# EasyEDA Pro project 有源低通滤波器.eprj

# Schematic Schematic1
Create Date: 2023-07-09; Page Name: P1; Project Name: 有源低通滤波器; Schematic Name: Schematic1; Update Date: 2023-07-09; Company: 嘉立创EDA; Page Size: A4; Version: V1.0
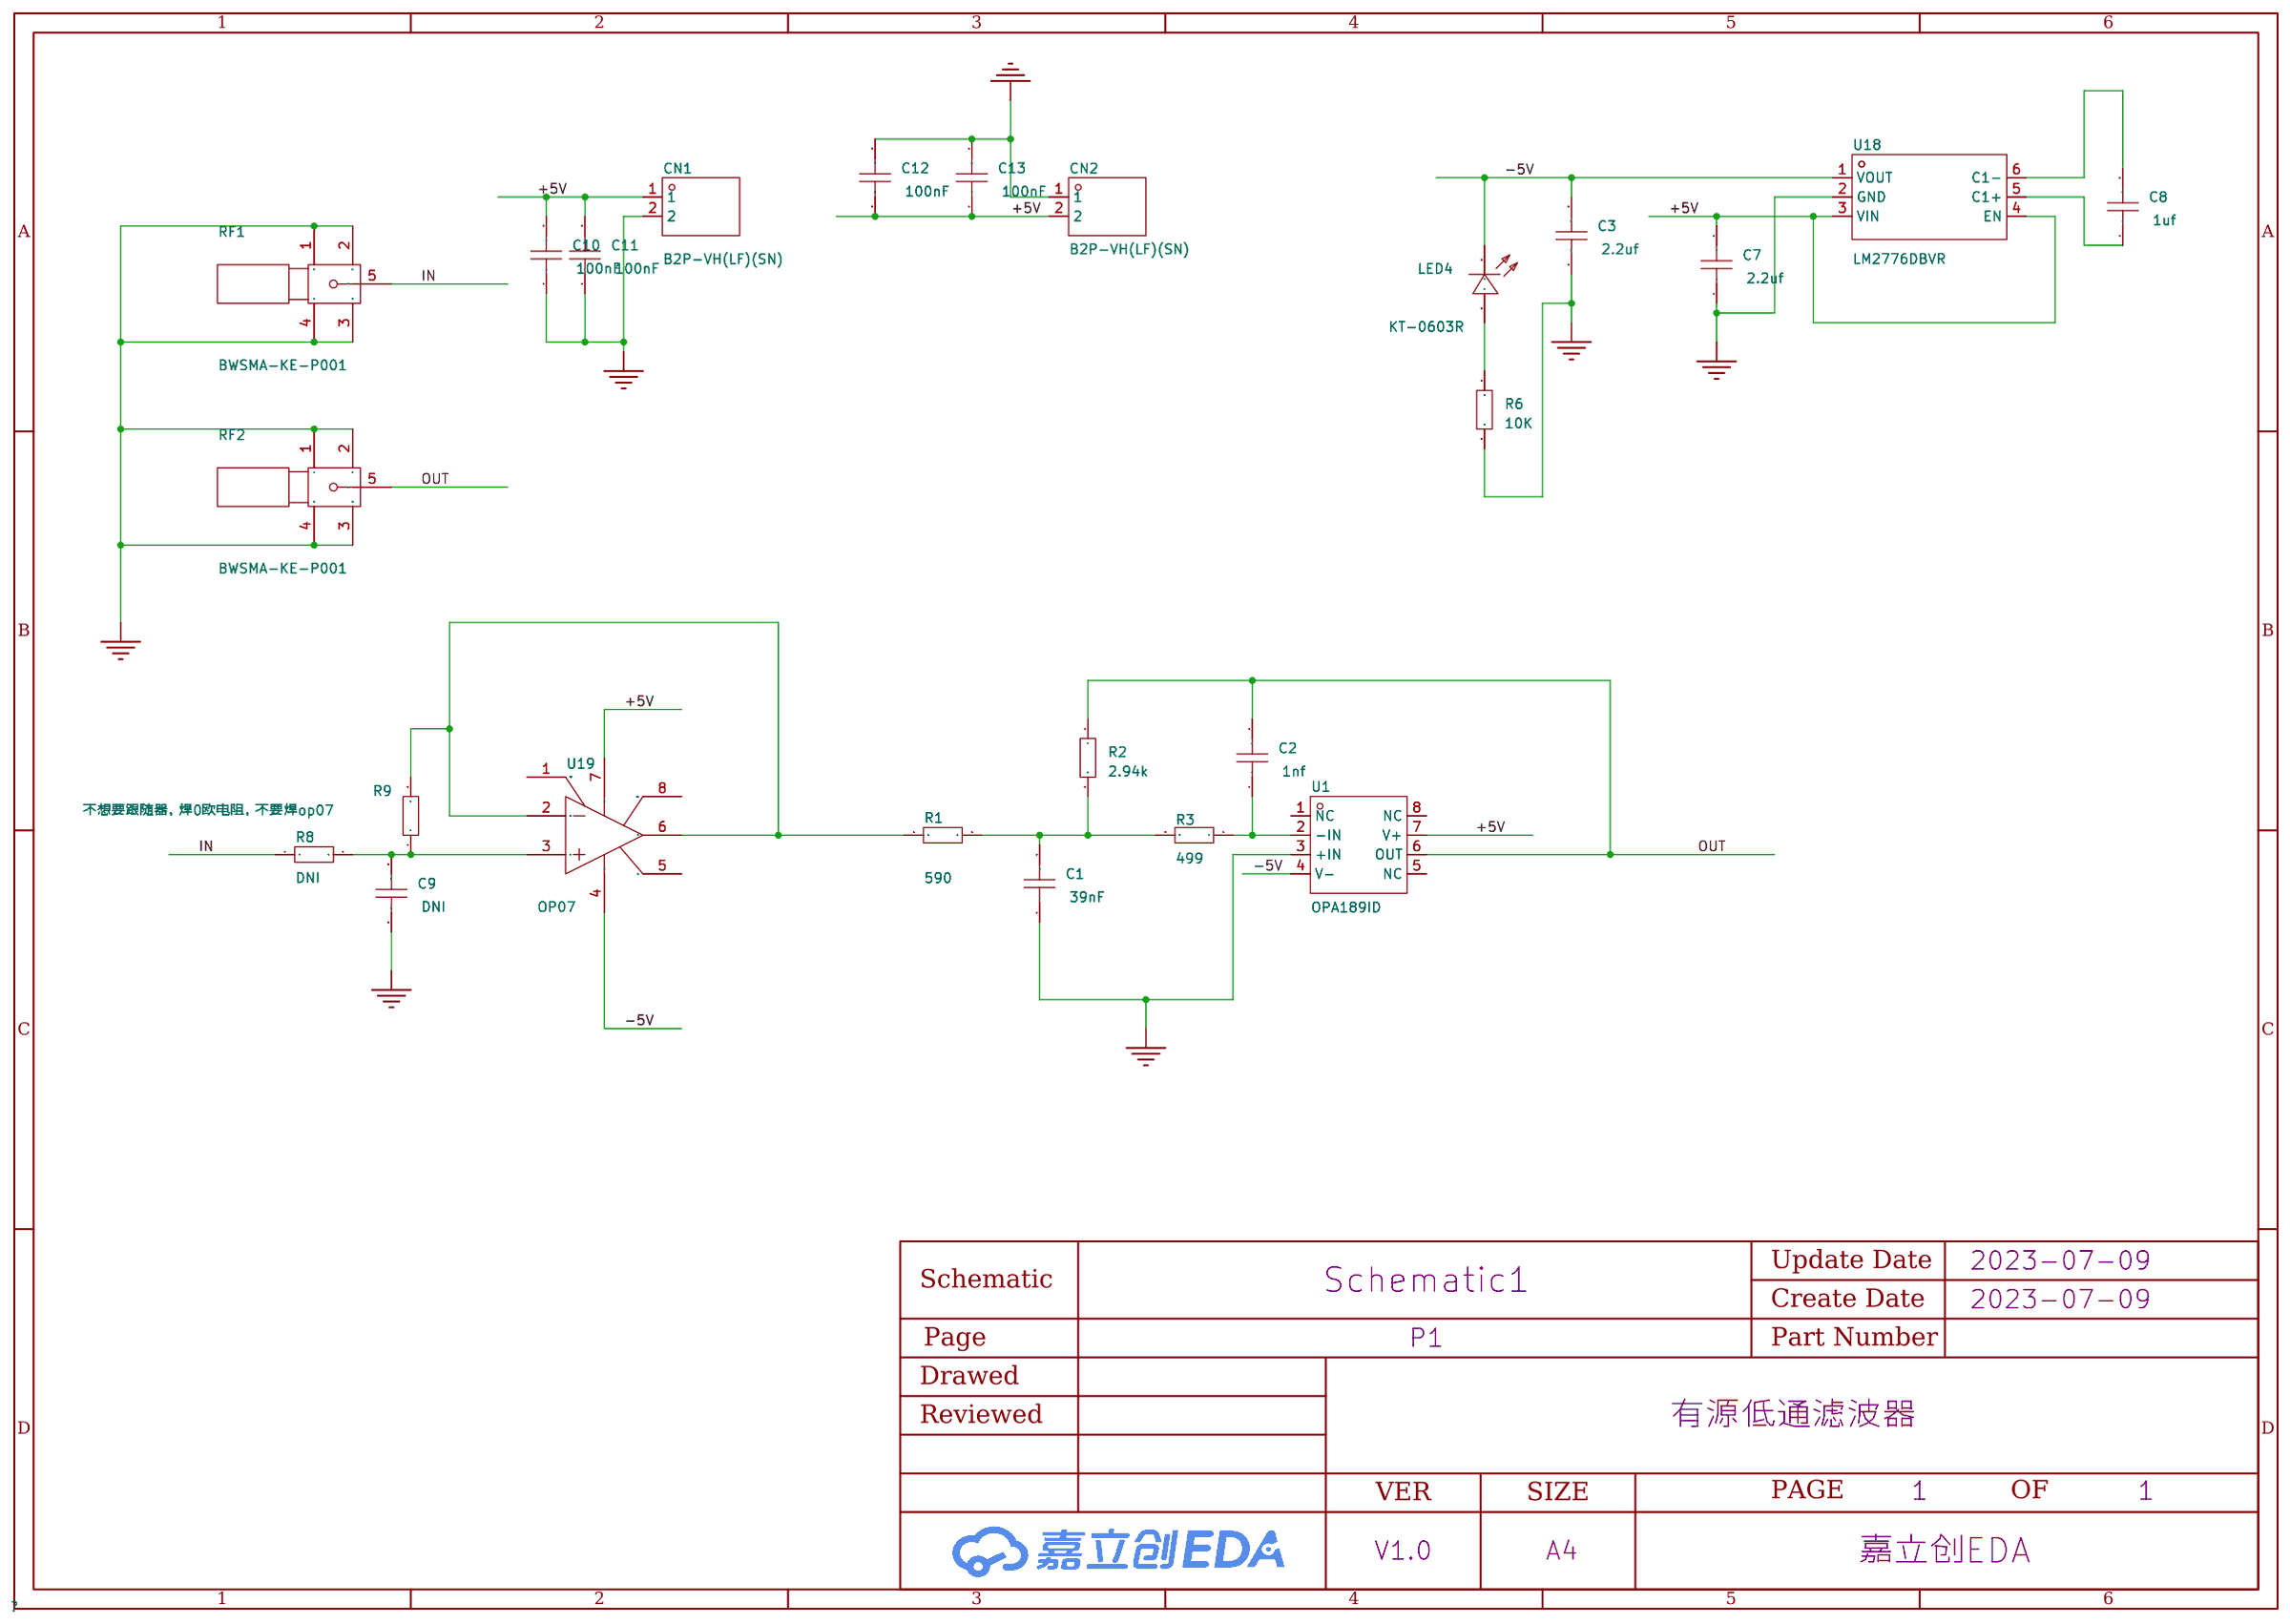
[diagram p0: schematic sheet]

## Parts
C1  39nF  [C0603]
C2  1nf  [C0603]
C3  2.2uf  [C0603]
C7  2.2uf  [C0603]
C8  1uf  [C0603]
C9  DNI  [C0603]
C10  100nF  [C0603]
C11  100nF  [C0603]
C12  100nF  [C0603]
C13  100nF  [C0603]
CN1  B2P-VH(LF)(SN)  [CONN-TH_B2P-VH-LF-SN]
CN2  B2P-VH(LF)(SN)  [CONN-TH_B2P-VH-LF-SN]
LED4  KT-0603R  [LED0603-RD]
R1  590  [R0603]
R2  2.94k  [R0603]
R3  499  [R0603]
R6  10K  [R0603]
R8  DNI  [R0603]
R9  不想要跟随器，焊0欧电阻，不要焊op07  [R0603]
RF1  BWSMA-KE-P001  [SMA-SMD_BWSMA-KE-P001]
RF2  BWSMA-KE-P001  [SMA-SMD_BWSMA-KE-P001]
U1  OPA189ID  [SOIC-8_L4.9-W3.9-P1.27-LS6.0-BL]
U18  LM2776DBVR  [SOT-23-6_L2.9-W1.6-P0.95-LS2.8-BR]
U19  OP07  [SOP-8_L4.9-W3.9-P1.27-LS6.0-BL]

## Library data of the parts
C1-C3 C7-C13 = CAP_0603: Supplier Footprint: 0603
CN1 CN2 = B2P-VH (LF)(SN): 参考系列:VH;间距:3.96mm;插针结构:1x2P;排数:1;每排PIN数:2;行距:-;安装方式:-;触头材质:黄铜;; LCSC Part Name: VH 3.96mm 1x2P 直插; Supplier Part: C160315; Manufacturer: JST; Supplier Footprint: 插件,P=3.96mm; JLCPCB Part Class: Extended Part; Datasheet: https://atta.szlcsc.com/upload/public/pdf/source/20180420/C160315_19C451141449BB9E1CAF8D49BAD03192.pdf; Supplier: LCSC; Reference Series: VH; Pitch: 3.96mm; Pins Structure: 1x2P; Number of Rows: 1; Number of PINs Per Row: 2; Contact Material: 黄铜
LED4 = KT-0603R: 发光颜色:红灯;二极管配置:-;透镜颜色:-;主波长:-;色温:-;功率:-;发光角度:-;安装方式:-;工作温度:-40℃~+85℃;; LCSC Part Name: 0603 红灯 高亮; Supplier Part: C2286; Manufacturer: KENTO; Supplier Footprint: 0603; JLCPCB Part Class: 基础库; Datasheet: https://atta.szlcsc.com/upload/public/pdf/source/20160616/1466072038404.pdf; Supplier: LCSC; Emitted Color: 红灯; Operating Temperature: -40℃~+85℃
R1-R3 R6 R8 R9 = Res_0603: Supplier Footprint: 0603
RF1 RF2 = BWSMA-KE-P001: 连接器类型:板端;射频系列:SMA;接口类型:内孔;端口数量:1;阻抗:50Ω;频率-最大值:12.4GHz;样式:偏脚;接口直径:5.2mm;接口长度/高度:-;工作温度范围:-;; LCSC Part Name: SMA 内孔 偏脚 SMA偏脚板端座子; Supplier Part: C496550; Manufacturer: BAT WIRELESS(蝙蝠无线); Supplier Footprint: 插件; JLCPCB Part Class: Extended Part; Datasheet: https://atta.szlcsc.com/upload/public/pdf/source/20200416/C496550_06668BF2E3B968EA39F96D17E7156373.pdf; Supplier: LCSC; Connector Type: 板端; RF Series: SMA; Interface Type: 内孔; Number of Ports: 1; Impedance: 50Ω; Frequency-Max: 12.4GHz; Style: 偏脚; Interface Diameter: 5.2mm
U1 = OPA189ID: 单路、14MHz、多路复用器友好型、低噪声、零漂移 、RRO、CMOS 精密运算放大器 8-SOIC -40 to 125; Supplier Part: C1346427; Manufacturer: TI(德州仪器); Supplier Footprint: SOIC-8; JLCPCB Part Class: 扩展库; Datasheet: https://atta.szlcsc.com/upload/public/pdf/source/20230221/021F59F95BC801D8417AEA2742D4D2F8.pdf; Supplier: LCSC
U18 = LM2776DBVR: 可输出电流:200mA;开关工作频率:2MHz;输出类型:Fixed;输出电压的路数:1;功能类型:Ratiometric;输出配置:Negative;; Supplier Part: C69527; Manufacturer: TI(德州仪器); Supplier Footprint: SOT-23-6; JLCPCB Part Class: Extended Part; Datasheet: https://atta.szlcsc.com/upload/public/pdf/source/20170908/C69527_1504870089399958035.pdf; Supplier: LCSC
U19 = OP07: 放大器组数:-;; Supplier Part: C1508997; Manufacturer: 杭州瑞盟; Supplier Footprint: SOP-8; JLCPCB Part Class: 扩展库; Datasheet: https://atta.szlcsc.com/upload/public/pdf/source/20201221/C1508997_31DB1D3DFE7BEFB064DC1C62AA82E0AA.pdf; Supplier: LCSC

## Nets
+5V: C7.2 C10.2 C11.2 C12.1 C13.1 CN1.1 CN2.2 U1.7(V+) U18.3(VIN) U18.4(EN) U19.7(V+)
-5V: C3.2 LED4.1(K) U1.4(V-) U18.1(VOUT) U19.4(V-)
GND: C1.1 C3.1 C7.1 C9.1 C10.1 C11.1 C12.2 C13.2 CN1.2 CN2.1 R6.2 RF1.1 RF1.2 RF1.3 RF1.4 RF2.1 RF2.2 RF2.3 RF2.4 U1.3(+IN) U18.2(GND)
IN: R8.1 RF1.5
OUT: C2.2 R2.1 RF2.5 U1.6(OUT)
$1N1168: LED4.2(A) R6.1
$1N1419: C1.2 R1.2 R2.2 R3.2
$1N1504: C2.1 R3.1 U1.2(-IN)
Net-(C8-1): C8.1 U18.5(C1+)
Net-(C8-2): C8.2 U18.6(C1-)
Net-(C9-2): C9.2 R8.2 R9.1 U19.3(IN+)
Net-(R1-1): R1.1 R9.2 U19.2(IN-) U19.6(OUT)

Not connected (* = marked no-connect by the designer): U1 1(NC) 5(NC) 8(NC); U19 1(VOS TRIM) 5(NC) 8(VOS TRIM)

# Board PCB1
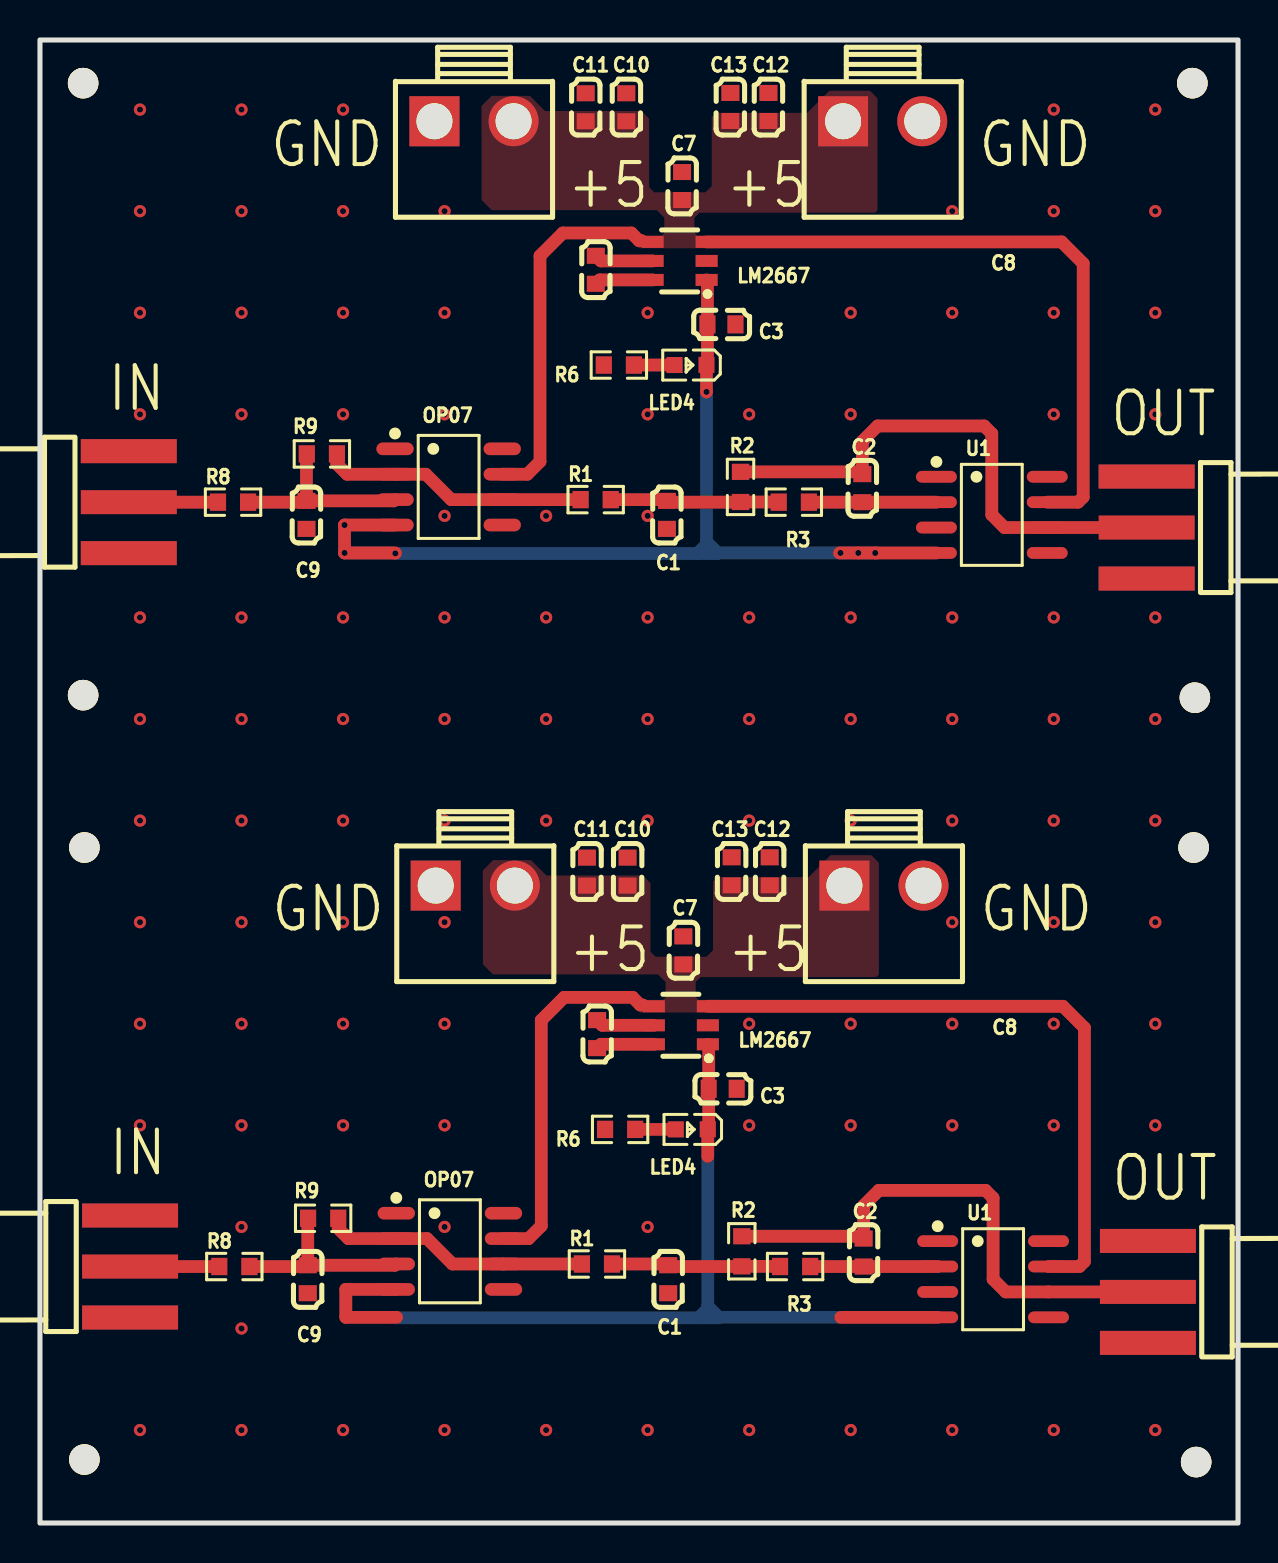
[diagram p1: board, top side]
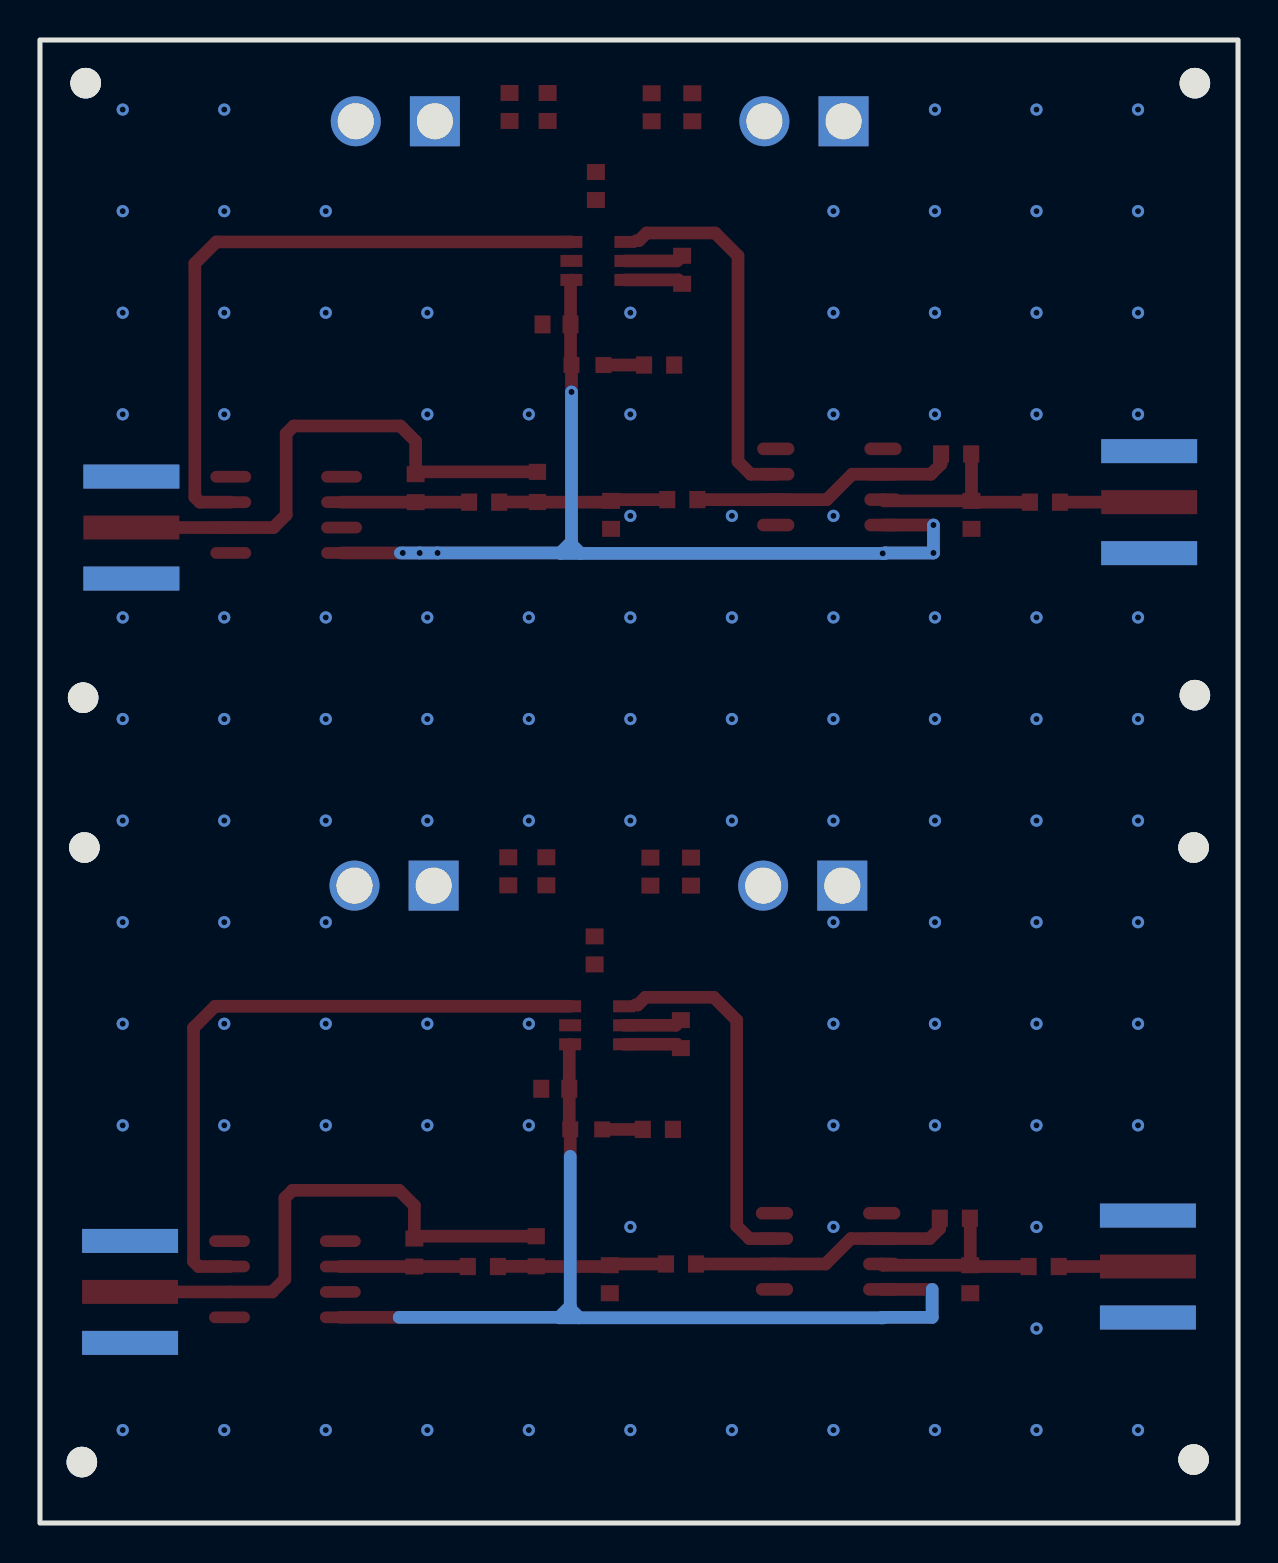
[diagram p2: board, bottom side, seen from below]

Outline 59.94 x 74.17 mm; copper layers: Top Layer, Bottom Layer. Coordinates in mm from the lower left corner of the outline.
Outline path: rectangle 0,74.17 59.94,0
Stack: Top Layer 0.035mm / Dielectric1 1.51mm FR4 er 4.5 / Bottom Layer 0.035mm

## Design rules (mm)
spacing safeClearance (default): track to track 0.152, other pairs 0.152 to 0.3
track width trackWidth (default): min 0.127, default 0.254, max 2.54
differential pair differentialPair (default): width min 0.127, default 0.254, max 2.54; gap min 0.152, default 0.152
via viaSize (default): diameter min 0.5, default 0.61, max 10; hole min 0.3, default 0.305, max 6

## Placement (name value [footprint] x y rotation side)
C1  39nF  [C0603]  31.37 50.42 90 top
C1#2  -  [C0603]  31.43 12.19 90 top
C2  1nf  [C0603]  41.15 51.75 90 top
C2#2  -  [C0603]  41.21 13.53 90 top
C3  2.2uf  [C0603]  34.16 21.72 180 top
C3#2  -  [C0603]  34.1 59.94 180 top
C7  2.2uf  [C0603]  32.13 66.86 270 top
C7#2  -  [C0603]  32.19 28.64 270 top
C8  1uf  [C0603]  27.88 24.45 270 top
C8#2  -  [C0603]  27.81 62.68 270 top
C9  DNI  [C0603]  13.33 50.42 90 top
C9#2  -  [C0603]  13.4 12.19 90 top
C10  100nF  [C0603]  29.34 70.8 270 top
C10#2  -  [C0603]  29.4 32.58 270 top
C11  100nF  [C0603]  27.37 32.58 270 top
C11#2  -  [C0603]  27.3 70.8 270 top
C12  100nF  [C0603]  36.45 70.82 90 top
C12#2  -  [C0603]  36.51 32.59 90 top
C13  100nF  [C0603]  34.54 70.82 90 top
C13#2  -  [C0603]  34.61 32.59 90 top
CN1  B2P-VH(LF)(SN)  [CONN-TH_B2P-VH-LF-SN]  42.16 70.1 0 top
CN1#2  -  [CONN-TH_B2P-VH-LF-SN]  42.23 31.88 0 top
CN2  B2P-VH(LF)(SN)  [CONN-TH_B2P-VH-LF-SN]  21.78 31.88 0 top
CN2#2  -  [CONN-TH_B2P-VH-LF-SN]  21.72 70.1 0 top
LED4  KT-0603R  [LED0603-RD]  32.61 19.69 180 top
LED4#2  -  [LED0603-RD]  32.55 57.92 180 top
LM2667  -  [SOT-23-6_L2.9-W1.6-P0.95-LS2.8-BR]  32 63.12 0 top
LM2667#2  -  [SOT-23-6_L2.9-W1.6-P0.95-LS2.8-BR]  32.07 24.89 0 top
NOREF  -  [SMA-SMD_BWSMA-KE-P001]  4.44 51.05 180 top
NOREF#2  -  [SMA-SMD_BWSMA-KE-P001]  4.51 12.83 180 top
NOREF#3  -  [Pad_e875]  57.72 33.78 0 top
NOREF#4  -  [Pad_e868]  2.22 33.78 0 top
NOREF#5  -  [Pad_e20]  2.16 72.01 0 top
NOREF#6  -  [Pad_e23]  2.16 41.4 0 top
NOREF#7  -  [Pad_e24]  57.78 41.27 0 top
NOREF#8  -  [Pad_e859]  57.85 3.05 0 top
NOREF#9  -  [Pad_e22]  57.66 72.01 0 top
NOREF#10  -  [Pad_e869]  2.22 3.17 0 top
OP07  -  [SOP-8_L4.9-W3.9-P1.27-LS6.0-BL]  20.45 51.82 270 top
OP07#2  -  [SOP-8_L4.9-W3.9-P1.27-LS6.0-BL]  20.51 13.59 270 top
R1  590  [R0603]  27.8 51.18 0 top
R1#2  -  [R0603]  27.87 12.95 0 top
R2  2.94k  [R0603]  35.05 51.82 270 top
R2#2  -  [R0603]  35.12 13.59 270 top
R3  499  [R0603]  37.72 51.05 180 top
R3#2  -  [R0603]  37.78 12.83 180 top
R6  10K  [R0603]  29.03 19.69 180 top
R6#2  -  [R0603]  28.96 57.91 180 top
R8  DNI  [R0603]  9.66 51.05 0 top
R8#2  -  [R0603]  9.72 12.83 0 top
R9  不想要跟随器，焊0欧电阻，不要焊op07  [R0603]  14.11 53.47 0 top
R9#2  -  [R0603]  14.17 15.24 0 top
RF2  BWSMA-KE-P001  [SMA-SMD_BWSMA-KE-P001]  55.37 49.78 0 top
RF2#2  -  [SMA-SMD_BWSMA-KE-P001]  55.44 11.56 0 top
U1  OPA189ID  [SOIC-8_L4.9-W3.9-P1.27-LS6.0-BL]  47.62 50.42 270 top
U1#2  -  [SOIC-8_L4.9-W3.9-P1.27-LS6.0-BL]  47.69 12.19 270 top

## Footprints (pads in the part's own frame, mm; a bottom-side part is the same pattern mirrored in y, then rotated)
C0603
  rect 0.8x0.9 smd: 1(-0.7,0) 2(0.7,0)
CONN-TH_B2P-VH-LF-SN
  rect 2.5x2.5 hole 1.8: 1(-1.98,0)
  round 2.5 hole 1.8: 2(1.98,0)
LED0603-RD
  rect 0.8x0.8 smd: 1(-0.799,-0.004) 2(0.799,0.004)
Pad_e20
  round 1.524 hole 3: 1(0,0)
Pad_e22
  round 1.524 hole 3: 1(0,0)
Pad_e23
  round 1.524 hole 3: 1(0,0)
Pad_e24
  round 1.524 hole 3: 1(0,0)
Pad_e859
  round 1.524 hole 3: 1(0,0)
Pad_e868
  round 1.524 hole 3: 1(0,0)
Pad_e869
  round 1.524 hole 3: 1(0,0)
Pad_e875
  round 1.524 hole 3: 1(0,0)
R0603
  rect 0.806x0.864 smd: 1(-0.753,0) 2(0.753,0)
SMA-SMD_BWSMA-KE-P001
  rect 4.8x1.2 smd: 1(0,-2.55) 2(0,2.55) 5(0,0)
  rect 4.8x1.2 smd far side: 3(0,2.55) 4(0,-2.55)
SOIC-8_L4.9-W3.9-P1.27-LS6.0-BL
  oval 0.588x2.045 smd: 1(-1.905,-2.772) 2(-0.635,-2.772) 3(0.635,-2.772) 4(1.905,-2.772) 5(1.905,2.772) 6(0.635,2.772) 7(-0.635,2.772) 8(-1.905,2.772)
SOP-8_L4.9-W3.9-P1.27-LS6.0-BL
  oval 0.63x1.865 smd: 1(-1.905,-2.683) 2(-0.635,-2.683) 3(0.635,-2.683) 4(1.905,-2.683) 5(1.905,2.683) 6(0.635,2.683) 7(-0.635,2.683) 8(-1.905,2.683)
SOT-23-6_L2.9-W1.6-P0.95-LS2.8-BR
  rect 1.1x0.6 smd: 1(1.35,-0.95) 2(1.35,0) 3(1.35,0.95) 4(-1.35,0.95) 5(-1.35,0) 6(-1.35,-0.95)

## Nets
+5V: C7.2 C7#2.2 C10.2 C10#2.2 C11.2 C11#2.2 C12.1 C12#2.1 C13.1 C13#2.1 CN1.1 CN1#2.1 CN2.2 CN2#2.2 LM2667.3 LM2667.4 LM2667#2.3 LM2667#2.4 OP07.7 OP07#2.7 U1.7 U1#2.7
-5V: C3.2 C3#2.2 LED4.1 LED4#2.1 LM2667.1 LM2667#2.1 OP07.4 OP07#2.4 U1.4 U1#2.4
GND: C1.1 C1#2.1 C3.1 C3#2.1 C7.1 C7#2.1 C9.1 C9#2.1 C10.1 C10#2.1 C11.1 C11#2.1 C12.2 C12#2.2 C13.2 C13#2.2 CN1.2 CN1#2.2 CN2.1 CN2#2.1 LM2667.2 LM2667#2.2 NOREF.1 NOREF.2 NOREF.3 NOREF.4 NOREF#2.1 NOREF#2.2 NOREF#2.3 NOREF#2.4 R6.2 R6#2.2 RF2.1 RF2.2 RF2.3 RF2.4 RF2#2.1 RF2#2.2 RF2#2.3 RF2#2.4 U1.3 U1#2.3
IN: NOREF.5 NOREF#2.5 R8.1 R8#2.1
OUT: C2.2 C2#2.2 R2.1 R2#2.1 RF2.5 RF2#2.5 U1.6 U1#2.6
$1N1165: C8.1 C8#2.1 LM2667.5 LM2667#2.5
$1N1166: C8.2 C8#2.2 LM2667.6 LM2667#2.6
$1N1168: LED4.2 LED4#2.2 R6.1 R6#2.1
$1N1419: C1.2 C1#2.2 R1.2 R1#2.2 R2.2 R2#2.2 R3.2 R3#2.2
$1N1504: C2.1 C2#2.1 R3.1 R3#2.1 U1.2 U1#2.2
$1N1994: OP07.2 OP07.6 OP07#2.2 OP07#2.6 R1.1 R1#2.1 R9.2 R9#2.2
$1N2080: C9.2 C9#2.2 OP07.3 OP07#2.3 R8.2 R8#2.2 R9.1 R9#2.1

Pads without a net: NOREF#3 1; NOREF#4 1; NOREF#5 1; NOREF#6 1; NOREF#7 1; NOREF#8 1; NOREF#9 1; NOREF#10 1; OP07 1 5 8; OP07#2 1 5 8; U1 1 5 8; U1#2 1 5 8

## Via types
v1: diameter 0.61, hole 0.304, Top Layer to Bottom Layer, 106 vias
v2: diameter 0.61, hole 0.305, Top Layer to Bottom Layer, 7 vias

## Routing (per net, layer and track width the routed paths; a pad name or vN(x,y) marks a point on that pad's centre or on a via; arc(x,y) is an arc through that point)
+5V: length 102.1
  Top Layer w0.635: 23.13,52.45 24.38,52.45 25.02,53.09 25.02,63.37 26.16,64.52 29.59,64.52 29.97,64.13 30.1,64.13 ; U1.7 51.94,51.05 52.2,51.31 52.2,62.99 51.12,64.07 LM2667.3 ; U1#2.7 52.01,12.83 52.26,13.08 52.26,24.77 51.18,25.84 LM2667#2.3 ; OP07#2.7 24.45,14.22 25.08,14.86 25.08,25.15 26.23,26.29 29.65,26.29 30.04,25.91 30.16,25.91
-5V: length 108.4
  Top Layer w0.635: v2(33.35,56.57) LED4#2.1 33.4,57.97 C3#2.2 33.4,62.12 LM2667.1 ; LM2667#2.1 33.46,23.9 C3.2 33.46,19.74 LED4.1 33.41,18.34 ; U1.4 v2(41.79,48.51) v2(40.94,48.51) 40,48.51 ; OP07.4 v2(15.24,49.91) v2(15.24,48.51) 17.78,48.51 ; 40.07,10.29 U1#2.4 ; 17.84,10.29 15.3,10.29 15.3,11.68 OP07#2.4
  Bottom Layer w0.635: 32.89,48.49 33.35,48.95 33.35,49.07 ; 32.89,48.49 v2(17.78,48.49) ; 32.89,48.49 33.89,48.49 33.91,48.51 ; 33.35,49.07 v2(33.35,56.57) ; 33.35,49.07 33.91,48.51 ; v2(17.78,48.49) 17.68,48.49 17.65,48.51 ; v2(17.78,48.49) 17.65,48.51 ; 33.97,10.29 41.97,10.29 ; 33.97,10.29 33.95,10.26 32.96,10.26 ; 33.97,10.29 33.41,10.85 ; 32.96,10.26 33.41,10.72 33.41,10.85 ; 32.96,10.26 17.84,10.26 ; 17.84,10.26 17.72,10.29 ; 17.84,10.26 17.74,10.26 17.72,10.29 ; 17.72,10.29 15.3,10.29 15.3,11.68 ; 17.65,48.51 v2(15.24,48.51) v2(15.24,49.91) ; 33.91,48.51 v2(40.05,48.51) v2(40.94,48.51) 41.91,48.51 ; 33.41,10.85 33.41,18.34
GND:
  vias: v1(5,70.69) v1(5,65.61) v1(5,60.53) v1(5,55.45) v1(5,45.29) v1(5,40.21) v1(5,35.13) v1(5,30.05) v1(5,24.97) v1(5,19.89) v1(5,4.65) v1(10.08,70.69) v1(10.08,65.61) v1(10.08,60.53) v1(10.08,55.45) v1(10.08,45.29) v1(10.08,40.21) v1(10.08,35.13) v1(10.08,30.05) v1(10.08,24.97) v1(10.08,19.89) v1(10.08,14.81) v1(10.08,9.73) v1(10.08,4.65) v1(15.16,70.69) v1(15.16,65.61) v1(15.16,60.53) v1(15.16,55.45) v1(15.16,45.29) v1(15.16,40.21) v1(15.16,35.13) v1(15.16,30.05) v1(15.16,24.97) v1(15.16,19.89) v1(15.16,4.65) v1(20.24,65.61) v1(20.24,60.53) v1(20.24,55.45) v1(20.24,50.37) v1(20.24,45.29) v1(20.24,40.21) v1(20.24,35.13) v1(20.24,30.05) v1(20.24,24.97) v1(20.24,19.89) v1(20.24,14.81) v1(20.24,4.65) v1(25.32,50.37) v1(25.32,45.29) v1(25.32,40.21) v1(25.32,35.13) v1(25.32,4.65) v1(30.4,60.53) v1(30.4,55.45) v1(30.4,50.37) v1(30.4,45.29) v1(30.4,40.21) v1(30.4,35.13) v1(30.4,14.81) v1(30.4,4.65) v1(35.48,55.45) v1(35.48,45.29) v1(35.48,40.21) v1(35.48,35.13) v1(35.48,24.97) v1(35.48,19.89) v1(35.48,4.65) v1(40.56,60.53) v1(40.56,55.45) v1(40.56,45.29) v1(40.56,40.21) v1(40.56,35.13) v1(40.56,24.97) v1(40.56,19.89) v1(40.56,4.65) v1(45.64,65.61) v1(45.64,60.53) v1(45.64,45.29) v1(45.64,40.21) v1(45.64,35.13) v1(45.64,30.05) v1(45.64,24.97) v1(45.64,19.89) v1(45.64,4.65) v1(50.72,70.69) v1(50.72,65.61) v1(50.72,60.53) v1(50.72,55.45) v1(50.72,45.29) v1(50.72,40.21) v1(50.72,35.13) v1(50.72,30.05) v1(50.72,24.97) v1(50.72,19.89) v1(50.72,4.65) v1(55.8,70.69) v1(55.8,65.61) v1(55.8,60.53) v1(55.8,55.45) v1(55.8,45.29) v1(55.8,40.21) v1(55.8,35.13) v1(55.8,30.05) v1(55.8,24.97) v1(55.8,19.89) v1(55.8,4.65)
IN: length 8.9
  Top Layer w0.635: NOREF.5 R8.1 ; NOREF#2.5 R8#2.1
OUT: length 53.6
  Top Layer w0.635: R2.1 41.03,52.57 C2.2 41.15,54.1 41.91,54.86 47.24,54.86 47.62,54.48 47.62,50.42 48.26,49.78 U1.6 RF2.5 ; R2#2.1 41.1,14.34 C2#2.2 41.21,15.88 41.97,16.64 47.31,16.64 47.69,16.26 47.69,12.19 48.32,11.56 U1#2.6 RF2#2.5
$1N1165: length 5.9
  Top Layer w0.635: C8.1 28.13,24.89 LM2667#2.5 ; C8#2.1 28.07,63.12 LM2667.5
$1N1166: length 5.8
  Top Layer w0.635: C8#2.2 28.01,62.17 LM2667.6 ; C8.2 28.07,23.94 LM2667#2.6
$1N1168: length 4.1
  Top Layer w0.635: R6#2.1 LED4#2.2 ; R6.1 31.81,19.69
$1N1419: length 16.9
  Top Layer w0.635: R3.2 36.96,51.06 R2.2 35.04,51.05 31.43,51.05 C1.2 31.31,51.18 R1.2 ; R1#2.2 31.37,12.95 C1#2.2 31.5,12.83 35.11,12.83 R2#2.2 37.02,12.84 R3#2.2
$1N1504: length 12.8
  Top Layer w0.635: R3#2.1 C2#2.1 U1#2.2 ; R3.1 C2.1 U1.2
$1N1994: length 26.9
  Top Layer w0.635: R9#2.2 14.92,14.73 15.43,14.22 OP07#2.2 19.37,14.22 20.64,12.95 OP07#2.6 R1#2.1 ; R1.1 OP07.6 20.57,51.18 19.3,52.45 15.37,52.45 14.86,52.96 R9.2
$1N2080: length 19.5
  Top Layer w0.635: C9#2.2 13.4,15.22 R9#2.1 ; C9#2.2 17.77,12.89 OP07#2.3 ; C9#2.2 13.33,12.83 R8#2.2 ; R8.2 13.27,51.05 C9.2 ; R9.1 13.33,53.45 C9.2 ; C9.2 17.7,51.12 OP07.3

## Copper pours and planes (outline as drawn; the poured copper is in the pictures)
+5V on Top Layer: 22.09,71.63 41.91,71.63 41.91,63.75 22.09,63.75
+5V on Top Layer: 22.15,33.4 41.97,33.4 41.97,25.53 22.15,25.53
GND on Top Layer: -11.81,79.25 74.93,79.25 74.93,-9.78 -11.81,-9.78
GND on Bottom Layer: -14.86,82.04 78.99,82.04 78.99,-17.02 -14.86,-17.02

## Text on the board
Top Solder Mask Layer: 有源低通滤波器
Top Silkscreen Layer: IN | GND | +5 | OUT
